# EAGLE design LAUNCHXL-F28027F_RevB (EAGLE 7.3.0)

## Sheet 1 of 2
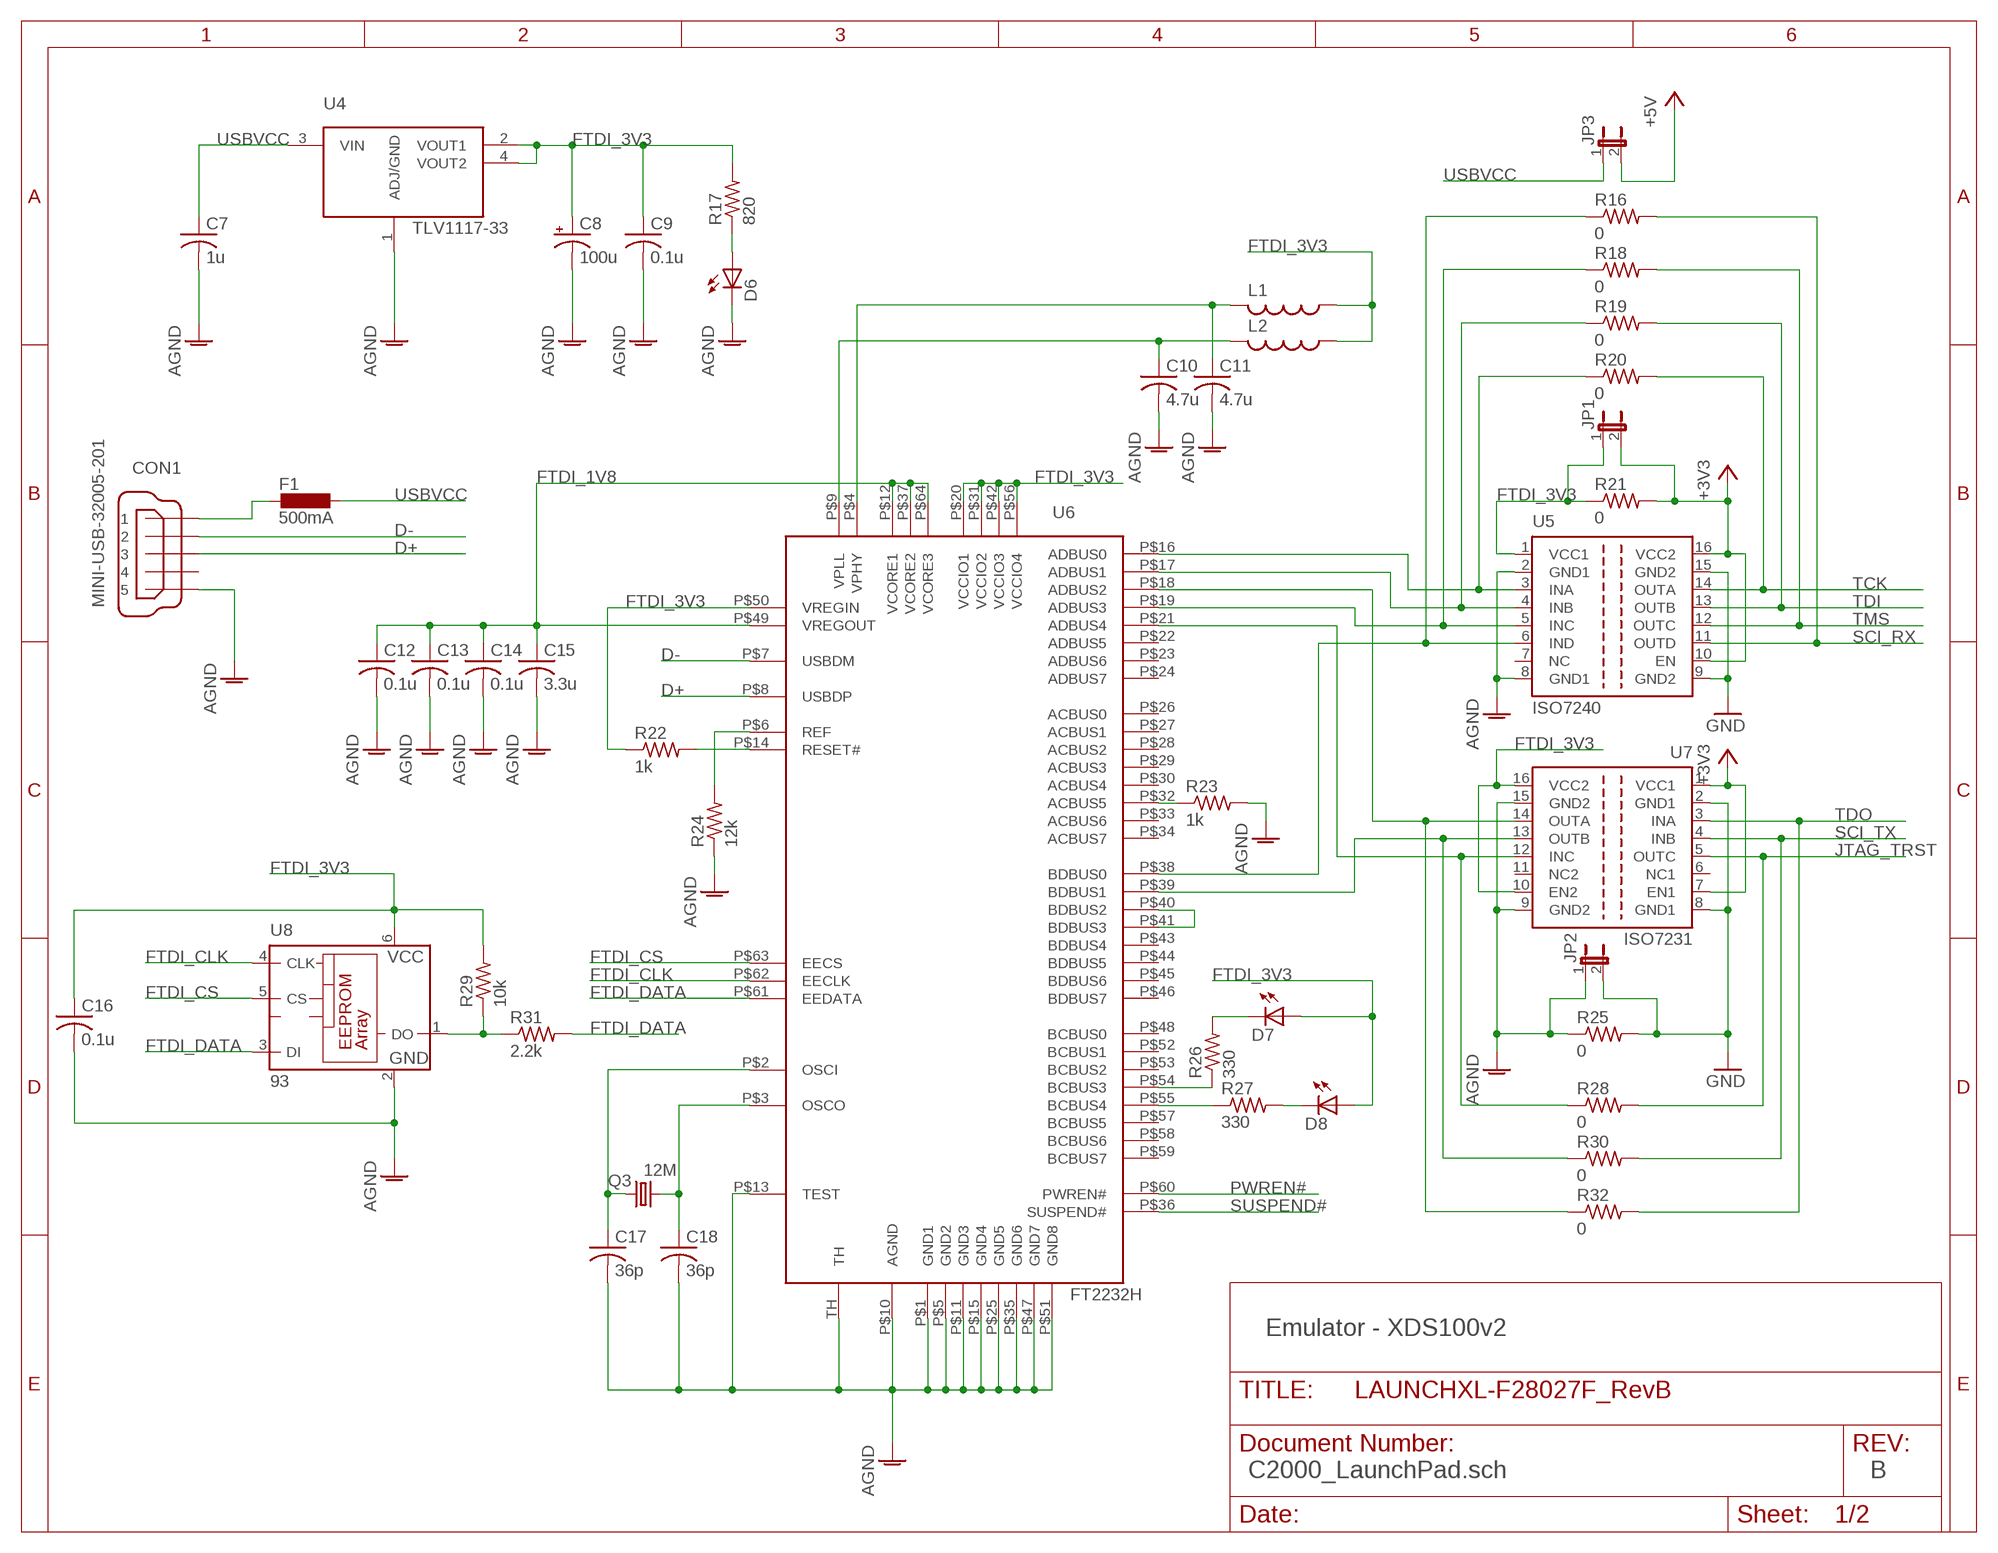
[diagram p0: schematic, sheet 1]

### Parts
C7  1u  C-USC0402  [C0402]
C8  100u  CPOL-USB/3528-21R  [B/3528-21R]
C9  0.1u  C-USC0402  [C0402]
C10  4.7u  C-USC0402  [C0402]
C11  4.7u  C-USC0402  [C0402]
C12  0.1u  C-USC0402  [C0402]
C13  0.1u  C-USC0402  [C0402]
C14  0.1u  C-USC0402  [C0402]
C15  3.3u  C-USC0402  [C0402]
C16  0.1u  C-USC0402  [C0402]
C17  36p  C-USC0402  [C0402]
C18  36p  C-USC0402  [C0402]
CON1  MINI-USB-32005-201  [32005-201]
D6  LEDCHIP-LED0603  [CHIP-LED0603]
D7  LEDCHIP-LED0603  [CHIP-LED0603]
D8  LEDCHIP-LED0603  [CHIP-LED0603]
F1  500mA  L-EUL1812  [L1812]
JP1  JP1ENORM  [JP1]
JP2  JP1ENORM  [JP1]
JP3  JP1ENORM  [JP1]
L1  L-US0402  [R0402]
L2  L-US0402  [R0402]
Q3  12M  CRYSTALHC49UP  [HC49UP]
R16  0  R-US_R1206  [R1206]
R17  820  R-US_R0402  [R0402]
R18  0  R-US_R1206  [R1206]
R19  0  R-US_R1206  [R1206]
R20  0  R-US_R1206  [R1206]
R21  0  R-US_R1206  [R1206]
R22  1k  R-US_R0402  [R0402]
R23  1k  R-US_R0402  [R0402]
R24  12k  R-US_R0402  [R0402]
R25  0  R-US_R1206  [R1206]
R26  330  R-US_R0402  [R0402]
R27  330  R-US_R0402  [R0402]
R28  0  R-US_R1206  [R1206]
R29  10k  R-US_R0402  [R0402]
R30  0  R-US_R1206  [R1206]
R31  2.2k  R-US_R0402  [R0402]
R32  0  R-US_R1206  [R1206]
U4  TLV1117-33  [SOT223]
U5  ISO7240  [SO-16DW]
U6  FT2232H  [QFN64]
U7  ISO7231  [SO-16DW]
U8  93  [SOT23-6]

### Nets
+3V3: JP1.2 R21.2 U5.10(EN) U5.16(VCC2) U7.1(VCC1) U7.7(EN1) ; also sheet 2
+5V: JP3.2 ; also sheet 2
AGND: C7.2 C8.- C9.2 C10.2 C11.2 C12.2 C13.2 C14.2 C15.2 C16.2 C17.2 C18.2 CON1.5 D6.C JP2.1 R23.2 R24.1 R25.1 U4.1(ADJ/GND) U5.2(GND1) U5.8(GND1) U6.P$1(GND1) U6.P$5(GND2) U6.P$10(AGND) U6.P$11(GND3) U6.P$13(TEST) U6.P$15(GND4) U6.P$25(GND5) U6.P$35(GND6) U6.P$47(GND7) U6.P$51(GND8) U6.TH U7.9(GND2) U7.15(GND2) U8.2(GND)
D+: CON1.3 U6.P$8(USBDP)
D-: CON1.2 U6.P$7(USBDM)
FTDI_1V8: C12.1 C13.1 C14.1 C15.1 U6.P$12(VCORE1) U6.P$37(VCORE2) U6.P$49(VREGOUT) U6.P$64(VCORE3)
FTDI_3V3: C8.+ C9.1 C16.1 D7.A D8.A JP1.1 L1.1 L2.1 R17.2 R21.1 R22.1 R29.2 U4.2(VOUT1) U4.4(VOUT2) U5.1(VCC1) U6.P$20(VCCIO1) U6.P$31(VCCIO2) U6.P$42(VCCIO3) U6.P$50(VREGIN) U6.P$56(VCCIO4) U7.10(EN2) U7.16(VCC2) U8.6(VCC)
FTDI_CLK: U6.P$62(EECLK) U8.4(CLK)
FTDI_CS: U6.P$63(EECS) U8.5(CS)
FTDI_DATA: R31.2 U6.P$61(EEDATA) U8.3(DI)
GND: JP2.2 R25.2 U5.9(GND2) U5.15(GND2) U7.2(GND1) U7.8(GND1) ; also sheet 2
JTAG_TRST: R28.2 U7.5(OUTC) ; also sheet 2
N$1: R20.1 U5.3(INA) U6.P$16(ADBUS0)
N$2: C17.1 Q3.1 U6.P$2(OSCI)
N$4: R19.1 U5.4(INB) U6.P$17(ADBUS1)
N$5: R32.1 U6.P$18(ADBUS2) U7.14(OUTA)
N$6: R18.1 U5.5(INC) U6.P$19(ADBUS3)
N$7: C18.1 Q3.2 U6.P$3(OSCO)
N$12: R29.1 R31.1 U8.1(DO)
N$13: R28.1 U6.P$21(ADBUS4) U7.12(INC)
N$14: R23.1 U6.P$32(ACBUS5)
N$15: U6.P$40(BDBUS2) U6.P$41(BDBUS3)
N$16: R16.1 U5.6(IND) U6.P$38(BDBUS0)
N$17: R24.2 U6.P$6(REF)
N$19: R26.1 U6.P$54(BCBUS3)
N$20: C11.1 L1.2 U6.P$4(VPHY)
N$21: R30.1 U6.P$39(BDBUS1) U7.13(OUTB)
N$22: R27.1 U6.P$55(BCBUS4)
N$23: D7.C R26.2
N$24: D8.C R27.2
N$26: C10.1 L2.2 U6.P$9(VPLL)
N$32: D6.A R17.1
N$34: R22.2 U6.P$14(RESET#)
PWREN#: U6.P$60(PWREN#)
SCI_RX: R16.2 U5.11(OUTD) ; also sheet 2
SCI_TX: R30.2 U7.4(INB) ; also sheet 2
SUSPEND#: U6.P$36(SUSPEND#)
TCK: R20.2 U5.14(OUTA) ; also sheet 2
TDI: R19.2 U5.13(OUTB) ; also sheet 2
TDO: R32.2 U7.3(INA) ; also sheet 2
TMS: R18.2 U5.12(OUTC) ; also sheet 2
USBVCC: C7.1 F1.1 JP3.1 U4.3(VIN)
XUSB: CON1.1 F1.2
Unconnected: CON1.4 U5.7(NC) U6.P$22(ADBUS5) U6.P$23(ADBUS6) U6.P$24(ADBUS7) U6.P$26(ACBUS0) U6.P$27(ACBUS1) U6.P$28(ACBUS2) U6.P$29(ACBUS3) U6.P$30(ACBUS4) U6.P$33(ACBUS6) U6.P$34(ACBUS7) U6.P$43(BDBUS4) U6.P$44(BDBUS5) U6.P$45(BDBUS6) U6.P$46(BDBUS7) U6.P$48(BCBUS0) U6.P$52(BCBUS1) U6.P$53(BCBUS2) U6.P$57(BCBUS5) U6.P$58(BCBUS6) U6.P$59(BCBUS7) U7.6(NC1) U7.11(NC2)

### Notes on the sheet
- Emulator - XDS100v2
- C2000_LaunchPad.sch | B

## Sheet 2 of 2
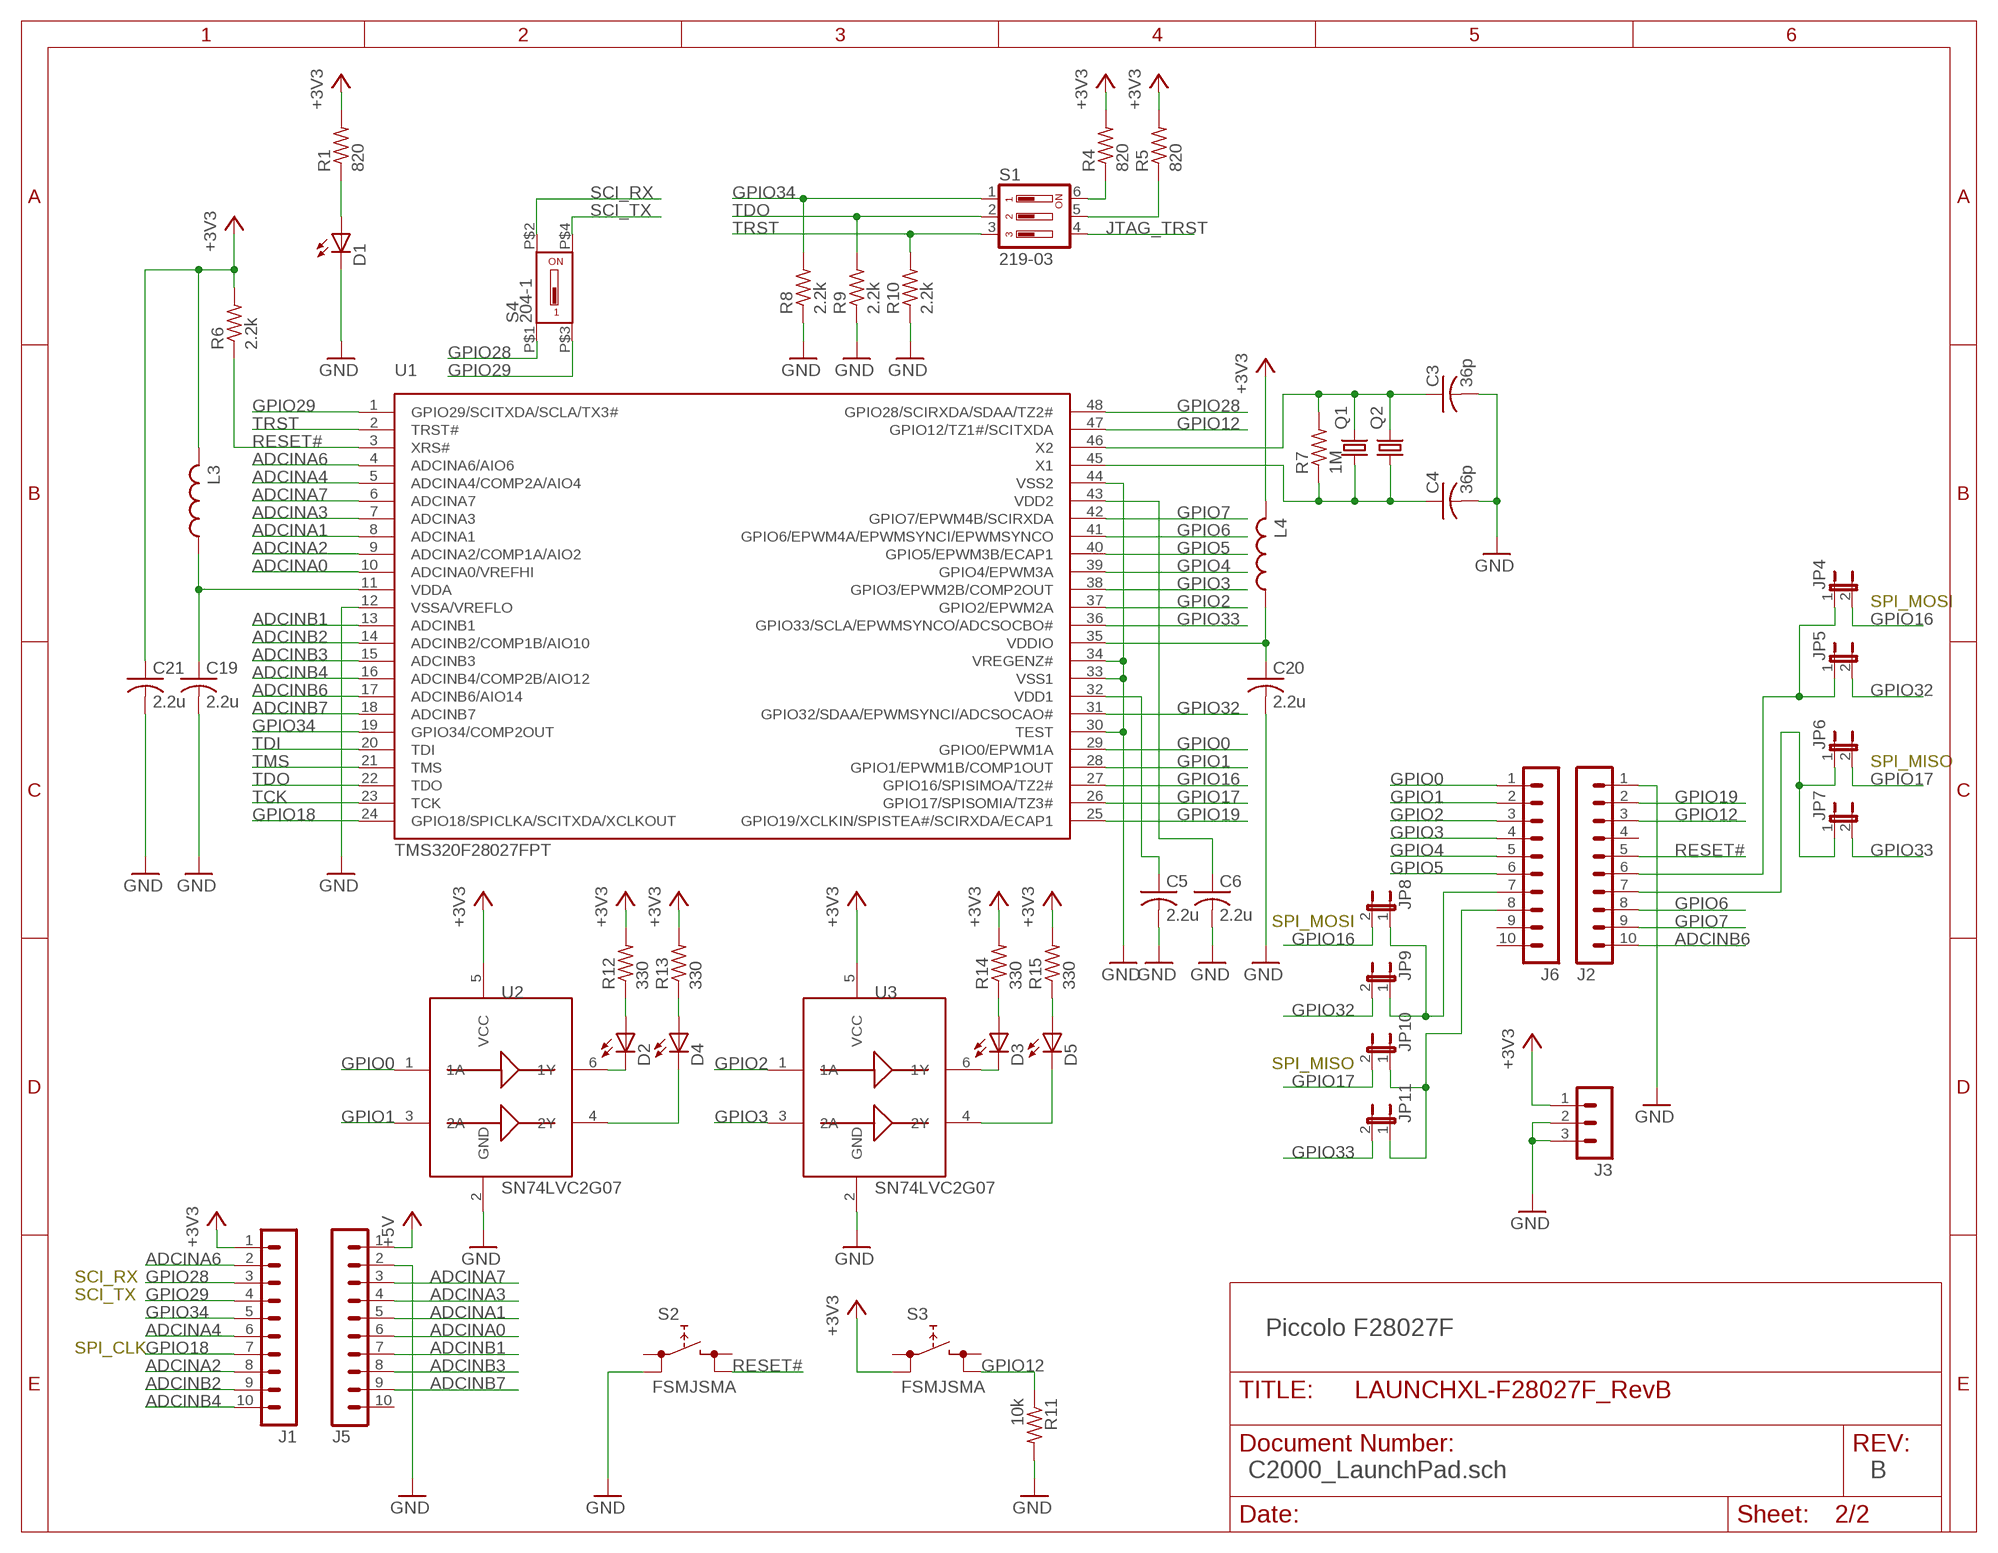
[diagram p1: schematic, sheet 2]

### Parts
C3  36p  C-USC0402  [C0402]
C4  36p  C-USC0402  [C0402]
C5  2.2u  C-USC0402  [C0402]
C6  2.2u  C-USC0402  [C0402]
C19  2.2u  C-USC0402  [C0402]
C20  2.2u  C-USC0402  [C0402]
C21  2.2u  C-USC0402  [C0402]
D1  LEDCHIP-LED0603  [CHIP-LED0603]
D2  LEDCHIP-LED0603  [CHIP-LED0603]
D3  LEDCHIP-LED0603  [CHIP-LED0603]
D4  LEDCHIP-LED0603  [CHIP-LED0603]
D5  LEDCHIP-LED0603  [CHIP-LED0603]
J1  MA10-1  [MA10-1]
J2  MA10-1  [MA10-1]
J3  MA03-1  [MA03-1]
J5  MA10-1  [MA10-1]
J6  MA10-1  [MA10-1]
JP4  JP1ECUT  [C0402]
JP5  JP1ECUT  [C0402]
JP6  JP1ECUT  [C0402]
JP7  JP1ECUT  [C0402]
JP8  JP1ECUT  [C0402]
JP9  JP1ECUT  [C0402]
JP10  JP1ECUT  [C0402]
JP11  JP1ECUT  [C0402]
L3  L-US0402  [R0402]
L4  L-US0402  [R0402]
Q1  CRYSTALHC49S  [HC49/S]
Q2  CRYSTALHC49UP  [HC49UP]
R1  820  R-US_R0402  [R0402]
R4  820  R-US_R0402  [R0402]
R5  820  R-US_R0402  [R0402]
R6  2.2k  R-US_R0402  [R0402]
R7  1M  R-US_R0402  [R0402]
R8  2.2k  R-US_R0402  [R0402]
R9  2.2k  R-US_R0402  [R0402]
R10  2.2k  R-US_R0402  [R0402]
R11  10k  R-US_R0402  [R0402]
R12  330  R-US_R0402  [R0402]
R13  330  R-US_R0402  [R0402]
R14  330  R-US_R0402  [R0402]
R15  330  R-US_R0402  [R0402]
S1  219-03  [CTS-219-03]
S2  FSMJSMA  [FSMJSMA]
S3  FSMJSMA  [FSMJSMA]
S4  204-1  [CTS-204-1]
U1  TMS320F28027FPT  TMS320F28027PT  [PQFP48]
U2  SN74LVC2G07  [SOT23-6-DBV]
U3  SN74LVC2G07  [SOT23-6-DBV]

### Nets
+3V3: C21.1 J1.1 J3.1 L3.2 L4.2 R1.2 R4.2 R5.2 R6.2 R12.2 R13.2 R14.2 R15.2 S3.P$2 U2.5(VCC) U3.5(VCC) ; also sheet 1
+5V: J5.1 ; also sheet 1
ADCINA0: J5.6 U1.10(ADCINA0/VREFHI)
ADCINA1: J5.5 U1.8(ADCINA1)
ADCINA2: J1.8 U1.9(ADCINA2/COMP1A/AIO2)
ADCINA3: J5.4 U1.7(ADCINA3)
ADCINA4: J1.6 U1.5(ADCINA4/COMP2A/AIO4)
ADCINA6: J1.2 U1.4(ADCINA6/AIO6)
ADCINA7: J5.3 U1.6(ADCINA7)
ADCINB1: J5.7 U1.13(ADCINB1)
ADCINB2: J1.9 U1.14(ADCINB2/COMP1B/AIO10)
ADCINB3: J5.8 U1.15(ADCINB3)
ADCINB4: J1.10 U1.16(ADCINB4/COMP2B/AIO12)
ADCINB6: J2.10 U1.17(ADCINB6/AIO14)
ADCINB7: J5.9 U1.18(ADCINB7)
GND: C3.2 C4.2 C5.2 C6.2 C19.2 C20.2 C21.2 D1.C J2.1 J3.2 J3.3 J5.2 R8.1 R9.1 R10.1 R11.2 S2.P$2 U1.12(VSSA/VREFLO) U1.30(TEST) U1.33(VSS1) U1.34(VREGENZ#) U1.44(VSS2) U2.2(GND) U3.2(GND) ; also sheet 1
GPIO0: J6.1 U1.29(GPIO0/EPWM1A) U2.1(1A)
GPIO1: J6.2 U1.28(GPIO1/EPWM1B/COMP1OUT) U2.3(2A)
GPIO2: J6.3 U1.37(GPIO2/EPWM2A) U3.1(1A)
GPIO3: J6.4 U1.38(GPIO3/EPWM2B/COMP2OUT) U3.3(2A)
GPIO4: J6.5 U1.39(GPIO4/EPWM3A)
GPIO5: J6.6 U1.40(GPIO5/EPWM3B/ECAP1)
GPIO6: J2.8 U1.41(GPIO6/EPWM4A/EPWMSYNCI/EPWMSYNCO)
GPIO7: J2.9 U1.42(GPIO7/EPWM4B/SCIRXDA)
GPIO12: J2.3 R11.1 S3.P$4 U1.47(GPIO12/TZ1#/SCITXDA)
GPIO16: JP4.2 JP8.2 U1.27(GPIO16/SPISIMOA/TZ2#)
GPIO17: JP6.2 JP10.2 U1.26(GPIO17/SPISOMIA/TZ3#)
GPIO18: J1.7 U1.24(GPIO18/SPICLKA/SCITXDA/XCLKOUT)
GPIO19: J2.2 U1.25(GPIO19/XCLKIN/SPISTEA#/SCIRXDA/ECAP1)
GPIO28: J1.3 S4.P$1 U1.48(GPIO28/SCIRXDA/SDAA/TZ2#)
GPIO29: J1.4 S4.P$3 U1.1(GPIO29/SCITXDA/SCLA/TX3#)
GPIO32: JP5.2 JP9.2 U1.31(GPIO32/SDAA/EPWMSYNCI/ADCSOCAO#)
GPIO33: JP7.2 JP11.2 U1.36(GPIO33/SCLA/EPWMSYNCO/ADCSOCBO#)
GPIO34: J1.5 R8.2 S1.1 U1.19(GPIO34/COMP2OUT)
J2: J2.6 JP4.1 JP5.1
JTAG_TRST: S1.4 ; also sheet 1
N$3: C19.1 L3.1 U1.11(VDDA)
N$8: C3.1 Q1.2 Q2.2 R7.2 U1.46(X2)
N$9: R4.1 S1.6
N$10: R5.1 S1.5
N$11: C4.1 Q1.1 Q2.1 R7.1 U1.45(X1)
N$18: C5.1 U1.32(VDD1)
N$25: C6.1 U1.43(VDD2)
N$27: D1.A R1.1
N$28: D2.C U2.6(1Y)
N$29: D4.C U2.4(2Y)
N$30: D2.A R12.1
N$31: D4.A R13.1
N$35: D3.C U3.6(1Y)
N$36: D5.C U3.4(2Y)
N$37: D3.A R14.1
N$38: D5.A R15.1
N$39: C20.1 L4.1 U1.35(VDDIO)
N$41: J6.7 JP8.1 JP9.1
N$42: J2.7 JP6.1 JP7.1
N$48: J6.8 JP10.1 JP11.1
RESET#: J2.5 R6.1 S2.P$4 U1.3(XRS#)
SCI_RX: S4.P$2 ; also sheet 1
SCI_TX: S4.P$4 ; also sheet 1
TCK: U1.23(TCK) ; also sheet 1
TDI: U1.20(TDI) ; also sheet 1
TDO: R9.2 S1.2 U1.22(TDO) ; also sheet 1
TMS: U1.21(TMS) ; also sheet 1
TRST: R10.2 S1.3 U1.2(TRST#)
Unconnected: J2.4 J5.10 J6.9 J6.10 S2.P$1 S2.P$3 S3.P$1 S3.P$3

### Notes on the sheet
- SPI_MOSI
- SPI_MISO
- SPI_MOSI
- SPI_MISO
- SCI_RX
- SCI_TX
- Piccolo F28027F
- SPI_CLK
- C2000_LaunchPad.sch | B

## Library data of the parts
C3-C7 C9-C21 = rcl:C-US: CAPACITOR, American symbol
C8 = rcl:CPOL-US: POLARIZED CAPACITOR, American symbol
CON1 = con-cypressindustries:MINI-USB-: MINI USB-B Conector Source: www.cypressindustries.com; OC_FARNELL: unknown; OC_NEWARK: unknown
D1-D8 = led:LED: LED OSRAM: - CHIPLED LG R971, LG N971, LY N971, LG Q971, LY Q971, LO R971, LY R971 LH N974, LH R974 LS Q976, LO Q976, LY Q976 LO Q996 - Hyper CHIPLED LW Q18S LB Q993, LB Q99A, LB R99A - SideLED LS A670, LO A670, LY A670, LG A670, LP A670 LB A673, LV A673, LT A673, LW A673 LH A674 LY A675 LS A676, LA A676, LO A676, LY A676, LW A676 LS A679, LY A679, LG A679 - Hyper Micro SIDELED® LS Y876, LA Y876, LO Y876, LY Y876 LT Y87S - SmartLED LW L88C, LW L88S LB L89C, LB L89S, LG L890 LS L89K, LO L89K, LY L89K LS L896, LA L896, LO L896, LY L896 - TOPLED LS T670, LO T670, LY T670, LG T670, LP T670 LSG T670, LSP T670, LSY T670, LOP T670, LYG T670 LG T671, LOG T671, LSG T671 LB T673, LV T673, LT T673, LW T673 LH T674 LS T676, LA T676, LO T676, LY T676, LB T676, LH T676, LSB T676, LW T676 LB T67C, LV T67C, LT T67C, LS T67K, LO T67K, LY T67K, LW E67C LS E67B, LA E67B, LO E67B, LY E67B, LB E67C, LV E67C, LT E67C LW T67C LS T679, LY T679, LG T679 LS T770, LO T770, LY T770, LG T770, LP T770 LB T773, LV T773, LT T773, LW T773 LH T774 LS E675, LA E675, LY E675, LS T675 LS T776, LA T776, LO T776, LY T776, LB T776 LHGB T686 LT T68C, LB T68C - Hyper Mini TOPLED® LB M676 - Mini TOPLED Santana® LG M470 LS M47K, LO M47K, LY M47K Source: http://www.osram.convergy.de LUXEON: - LUMILED® LXK2-PW12-R00, LXK2-PW12-S00, LXK2-PW14-U00, LXK2-PW14-V00 LXK2-PM12-R00, LXK2-PM12-S00, LXK2-PM14-U00 LXK2-PE12-Q00, LXK2-PE12-R00, LXK2-PE12-S00, LXK2-PE14-T00, LXK2-PE14-U00 LXK2-PB12-K00, LXK2-PB12-L00, LXK2-PB12-M00, LXK2-PB14-N00, LXK2-PB14-P00, LXK2-PB14-Q00 LXK2-PR12-L00, LXK2-PR12-M00, LXK2-PR14-Q00, LXK2-PR14-R00 LXK2-PD12-Q00, LXK2-PD12-R00, LXK2-PD12-S00 LXK2-PH12-R00, LXK2-PH12-S00 LXK2-PL12-P00, LXK2-PL12-Q00, LXK2-PL12-R00 Source: www.luxeon.com KINGBRIGHT: KA-3528ASYC Source: www.kingbright.com
F1 = rcl:L-EU: INDUCTOR, European symbol
J1 J2 J5 J6 = con-lstb:MA10-1: PIN HEADER; OC_FARNELL: unknown; OC_NEWARK: unknown
J3 = con-lstb:MA03-1: PIN HEADER; OC_FARNELL: unknown; OC_NEWARK: unknown
JP1-JP11 = jumper:JP1E: JUMPER
L1-L4 = rcl:L-US: INDUCTOR, American symbol
Q1 = crystal:CRYSTAL: CRYSTAL; OC_FARNELL: 1667008; OC_NEWARK: unknown
Q2 Q3 = crystal:CRYSTAL: CRYSTAL; OC_FARNELL: unknown; OC_NEWARK: unknown
R1 R4-R32 = rcl:R-US_: RESISTOR, American symbol
S1 = switch-dil:219-03*: Surface Mount DIP Switch Series 219 SMT CTS Electronic Components Sourc: www.ctscorp.com; OC_FARNELL: unknown; OC_NEWARK: unknown
S2 S3 = switch:FSMJSMA
S4 = switch-dil:204-1*
U1 = texas:TMS320F28027
U2 U3 = texas:SN74LVC2G07
U4 = texas:TLV1117
U5 = texas:ISO7240: HIGH SPEED QUAD DIGITAL ISOLATORS Source: http://focus.ti.com/lit/ds/symlink/iso7240m.pdf; MPN: ISO7240MDW; OC_FARNELL: 1755124; OC_NEWARK: 58M0385
U6 = ti_trey:FT2232H
U7 = texas:ISO7231
U8 = ti_trey:93*: Serial EPROM 1 K/2 K/4 K, low voltage, Microwire

## Net classes
0 default: width 0.152 mm, drill 0.305 mm, clearance 0.152 mm

## Board
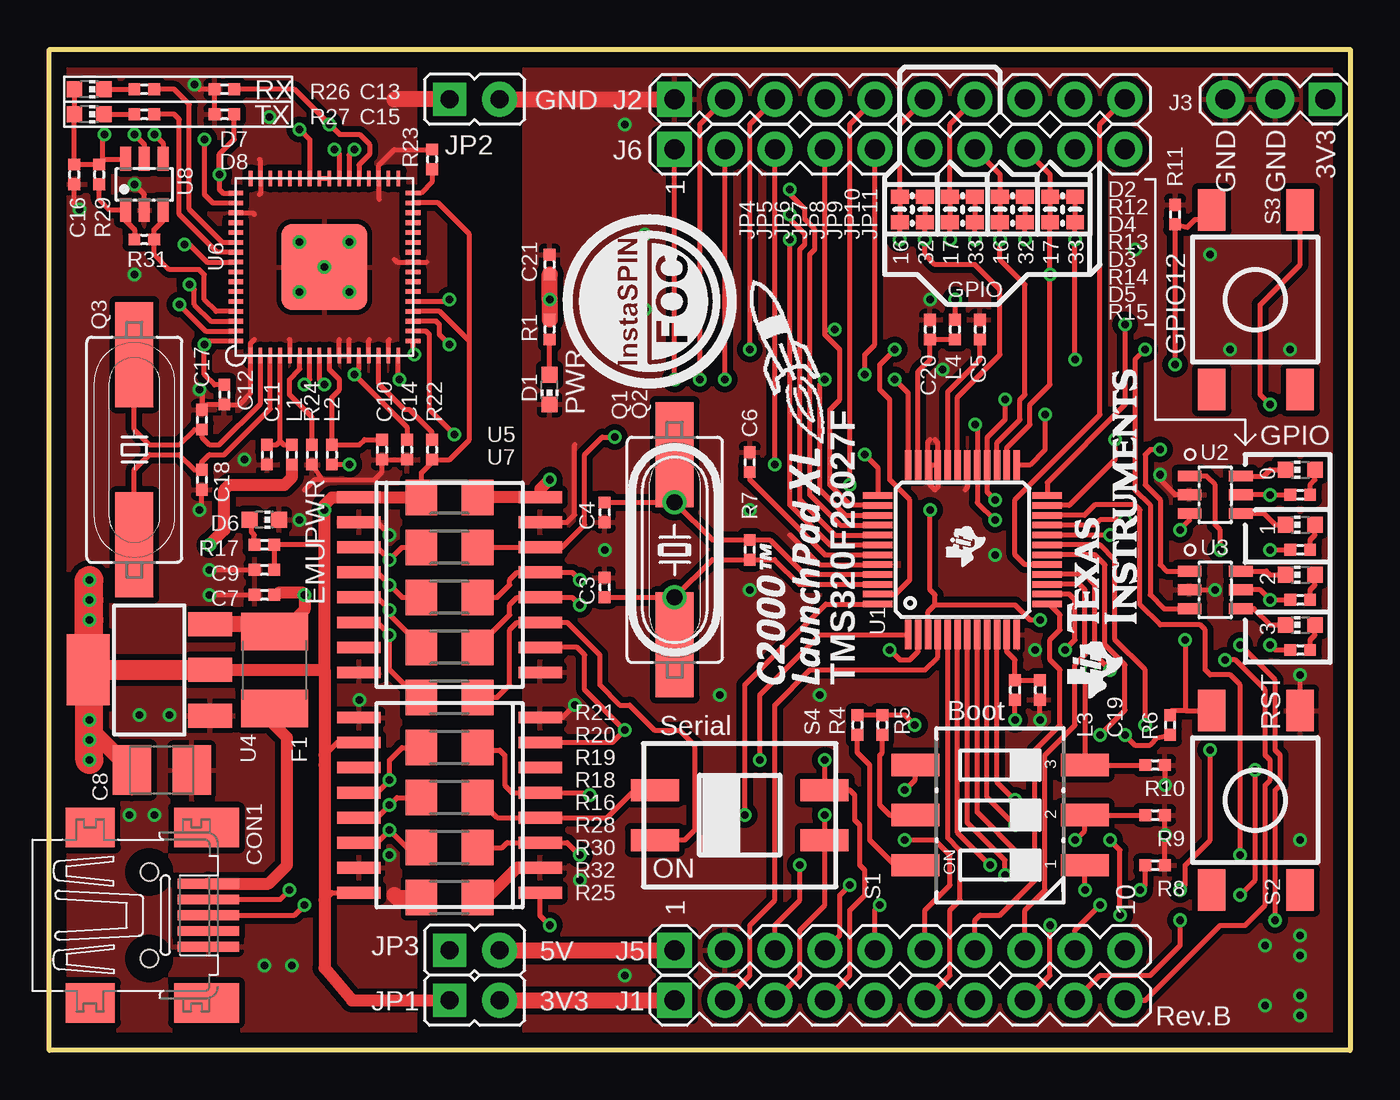
[diagram p2: board, top side]
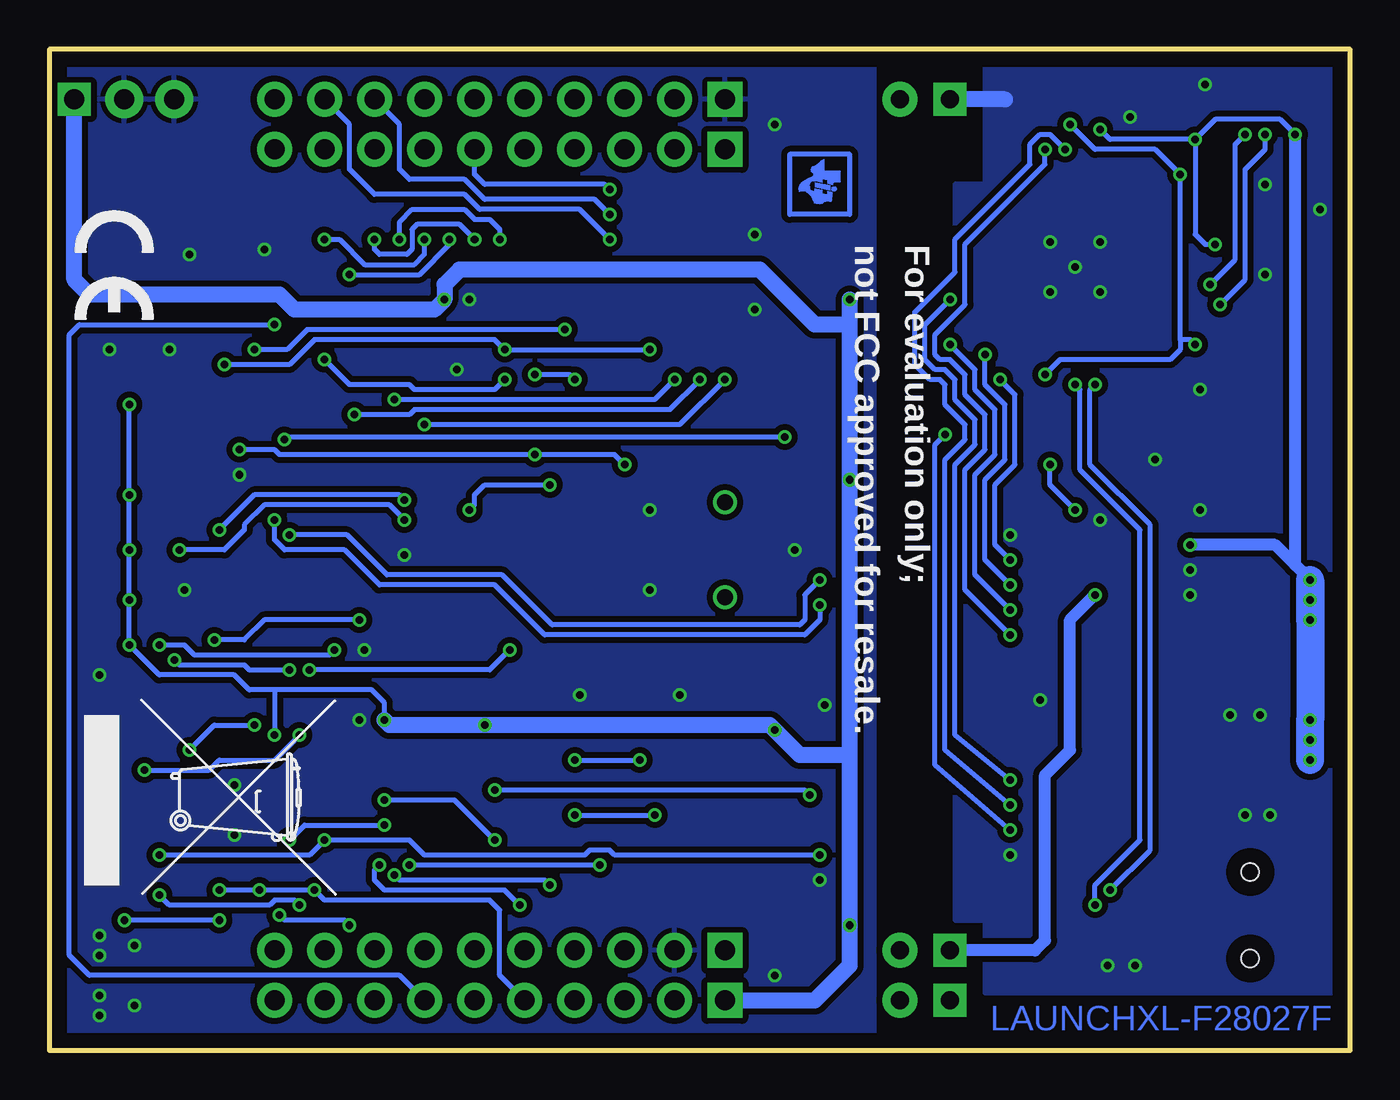
[diagram p3: board, bottom side, seen from below]

Size 66.04 x 50.8 mm. Coordinates in mm from the lower left corner, seen from the top.
Outline: 0,50.8 66.04,50.8 66.04,0 0,0 0,50.8
Copper layers (1*16): Top 0.035mm / dielectric 1.5mm / Bottom 0.035mm
Design rules "default *": minimum track width 6mil, minimum drill 15mil, track to track 6mil, track to pad 6mil, pad to pad 6mil, via to via 6mil, smd to smd 6mil, copper to edge 30mil, drill to drill 12mil, minimum pad ring 6mil, minimum via ring 6mil, stop-mask expansion 1mil, vias tented up to drill 20mil, thermal gap 10mil
bRestrict: area 25.7,42.7 to 28.2,45.2

### Footprints (pad centres in the part's own frame; a part is rotated, then mirrored left to right if it is on the bottom)
C0402 = smd 0.6 x 0.6: 1 -0.5,0; 2 0.5,0
B/3528-21R = smd 1.95 x 2.5: + 1.525,0; - -1.525,0
32005-201 = smd 3.1 x 0.5: 1 3,1.6; 2 3,0.8; 3 3,0; 4 3,-0.8; 5 3,-1.6 | smd 2.5 x 2: M1 -3,-4.45; M2 -3,4.45 | smd 3.3 x 2: M3 2.9,4.45; M4 2.9,-4.45 | hole 0.9: 0,2.2; 0,-2.2
CHIP-LED0603 = smd 0.8 x 0.8: A 0,-0.75; C 0,0.75
L1812 = smd 1.9 x 3.4: 1 -1.95,0; 2 1.95,0
MA10-1 = drill 1.016 pad 1.778 square: 1 -11.43,0 | drill 1.016 pad 1.778: 2 -8.89,0; 3 -6.35,0; 4 -3.81,0; 5 -1.27,0; 6 1.27,0; 7 3.81,0; 8 6.35,0; 9 8.89,0; 10 11.43,0
MA03-1 = drill 1.016 pad 1.676 square: 1 -2.54,0 | drill 1.016 pad 1.93: 2 0,0; 3 2.54,0
JP1 = drill 0.914 pad 1.676 square: 1 0,-1.27 | drill 0.914 pad 1.778: 2 0,1.27
C0402' = smd 0.7 x 0.9: 1 -0.65,0; 2 0.65,0
R0402 = smd 0.6 x 0.6: 1 -0.5,0; 2 0.5,0
HC49/S = drill 0.813: 1 -2.413,0; 2 2.413,0
HC49UP = smd 5.334 x 1.93: 1 -4.826,0; 2 4.826,0
R1206 = smd 1.6 x 1.803: 1 -1.422,0; 2 1.422,0
CTS-219-03 = smd 1.13 x 2.44: 1 -2.54,-4.3; 2 0,-4.3; 3 2.54,-4.3; 4 2.54,4.3; 5 0,4.3; 6 -2.54,4.3
FSMJSMA = smd 1.397 x 2.108: P$1 0,0; P$2 0,-9.119; P$3 4.496,0; P$4 4.496,-9.119
CTS-204-1 = smd 1.118 x 2.438: P$1 -1.27,-4.305; P$2 -1.27,4.305; P$3 1.27,-4.305; P$4 1.27,4.305
PQFP48 = smd 1.5 x 0.33: 1 -4.3,2.75; 2 -4.3,2.25; 3 -4.3,1.75; 4 -4.3,1.25; 5 -4.3,0.75; 6 -4.3,0.25; 7 -4.3,-0.25; 8 -4.3,-0.75; 9 -4.3,-1.25; 10 -4.3,-1.75; 11 -4.3,-2.25; 12 -4.3,-2.75; 25 4.3,-2.75; 26 4.3,-2.25; 27 4.3,-1.75; 28 4.3,-1.25; 29 4.3,-0.75; 30 4.3,-0.25; 31 4.3,0.25; 32 4.3,0.75; 33 4.3,1.25; 34 4.3,1.75; 35 4.3,2.25; 36 4.3,2.75 | smd 0.33 x 1.5: 13 -2.75,-4.3; 14 -2.25,-4.3; 15 -1.75,-4.3; 16 -1.25,-4.3; 17 -0.75,-4.3; 18 -0.25,-4.3; 19 0.25,-4.3; 20 0.75,-4.3; 21 1.25,-4.3; 22 1.75,-4.3; 23 2.25,-4.3; 24 2.75,-4.3; 37 2.75,4.3; 38 2.25,4.3; 39 1.75,4.3; 40 1.25,4.3; 41 0.75,4.3; 42 0.25,4.3; 43 -0.25,4.3; 44 -0.75,4.3; 45 -1.25,4.3; 46 -1.75,4.3; 47 -2.25,4.3; 48 -2.75,4.3
SOT23-6-DBV = smd 0.55 x 1.2: 1 -0.95,-1.3; 2 0,-1.3; 3 0.95,-1.3; 4 0.95,1.3; 5 0,1.3; 6 -0.95,1.3
SOT223 = smd 1.219 x 2.235: 1 -2.311,-3.099; 2 0,-3.099; 3 2.311,-3.099 | smd 3.6 x 2.2: 4 0,3.099
SO-16DW = smd 0.6 x 2.2: 1 -4.445,-4.6; 2 -3.175,-4.6; 3 -1.905,-4.6; 4 -0.635,-4.6; 5 0.635,-4.6; 6 1.905,-4.6; 7 3.175,-4.6; 8 4.445,-4.6; 9 4.445,4.6; 10 3.175,4.6; 11 1.905,4.6; 12 0.635,4.6; 13 -0.635,4.6; 14 -1.905,4.6; 15 -3.175,4.6; 16 -4.445,4.6
QFN64 = smd 0.8 x 0.25: P$1 -4.5,3.75; P$2 -4.5,3.25; P$3 -4.5,2.75; P$4 -4.5,2.25; P$5 -4.5,1.75; P$6 -4.5,1.25; P$7 -4.5,0.75; P$8 -4.5,0.25; P$9 -4.5,-0.25; P$10 -4.5,-0.75; P$11 -4.5,-1.25; P$12 -4.5,-1.75; P$13 -4.5,-2.25; P$14 -4.5,-2.75; P$15 -4.5,-3.25; P$16 -4.5,-3.75; P$33 4.5,-3.75; P$34 4.5,-3.25; P$35 4.5,-2.75; P$36 4.5,-2.25; P$37 4.5,-1.75; P$38 4.5,-1.25; P$39 4.5,-0.75; P$40 4.5,-0.25; P$41 4.5,0.25; P$42 4.5,0.75; P$43 4.5,1.25; P$44 4.5,1.75; P$45 4.5,2.25; P$46 4.5,2.75; P$47 4.5,3.25; P$48 4.5,3.75 | smd 0.25 x 0.8: P$17 -3.75,-4.5; P$18 -3.25,-4.5; P$19 -2.75,-4.5; P$20 -2.25,-4.5; P$21 -1.75,-4.5; P$22 -1.25,-4.5; P$23 -0.75,-4.5; P$24 -0.25,-4.5; P$25 0.25,-4.5; P$26 0.75,-4.5; P$27 1.25,-4.5; P$28 1.75,-4.5; P$29 2.25,-4.5; P$30 2.75,-4.5; P$31 3.25,-4.5; P$32 3.75,-4.5; P$49 3.75,4.5; P$50 3.25,4.5; P$51 2.75,4.5; P$52 2.25,4.5; P$53 1.75,4.5; P$54 1.25,4.5; P$55 0.75,4.5; P$56 0.25,4.5; P$57 -0.25,4.5; P$58 -0.75,4.5; P$59 -1.25,4.5; P$60 -1.75,4.5; P$61 -2.25,4.5; P$62 -2.75,4.5; P$63 -3.25,4.5; P$64 -3.75,4.5 | smd 4.35 x 4.35: TH 0,0
SOT23-6 = smd 0.55 x 1.2: 1 -0.95,-1.3; 2 0,-1.3; 3 0.95,-1.3; 4 0.95,1.3; 5 0,1.3; 6 -0.95,1.3

### Placement (x,y rotation side)
C3  28.19,23.5 90 top
C4  28.19,27.3 270 top
C5  47.24,36.58 90 top
C6  35.56,29.84 90 top
C7  10.92,23.11 180 top
C8  5.71,14.22 180 top
C9  10.92,24.38 180 top
C10  16.89,30.48 270 top
C11  11.05,30.23 270 top
C12  8.89,33.27 270 top
C13  8.89,48.77 180 top
C14  18.16,30.48 270 top
C15  8.89,47.5 180 top
C16  1.27,44.45 270 top
C17  7.75,32 90 top
C18  7.75,28.96 270 top
C19  50.29,18.29 270 top
C20  44.7,36.58 90 top
C21  25.4,39.88 90 top
CON1  5.08,6.86 0 top
D1  25.4,33.53 180 top
D2  63.5,29.46 90 top
D3  63.5,24.13 90 top
D4  63.5,26.67 90 top
D5  63.5,21.59 90 top
D6  10.92,26.92 270 top
D7  2.03,48.77 270 top
D8  2.03,47.5 270 top
F1  11.43,19.3 270 top
J1  43.18,2.54 0 top
J2  43.18,48.26 0 top
J3  62.23,48.26 180 top
J5  43.18,5.08 0 top
J6  43.18,45.72 0 top
JP1  21.59,2.54 270 top
JP2  21.59,48.26 270 top
JP3  21.59,5.08 270 top
JP4  [C0402']  43.18,42.67 270 top
JP5  [C0402']  44.45,42.67 270 top
JP6  [C0402']  45.72,42.67 270 top
JP7  [C0402']  46.99,42.67 270 top
JP8  [C0402']  48.26,42.67 270 top
JP9  [C0402']  49.53,42.67 270 top
JP10  [C0402']  50.8,42.67 270 top
JP11  [C0402']  52.07,42.67 270 top
L1  12.32,30.23 90 top
L2  14.35,30.23 90 top
L3  49.02,18.29 270 top
L4  45.97,36.58 90 top
Q1  31.75,25.4 270 top
Q2  31.75,25.4 270 top
Q3  4.32,30.48 270 top
R1  25.4,36.58 90 top
R4  41.02,16.51 90 top
R5  42.29,16.51 90 top
R6  56.9,16.51 270 top
R7  35.56,25.4 270 top
R8  56.13,9.4 180 top
R9  56.13,11.94 180 top
R10  56.13,14.48 180 top
R11  57.15,42.42 90 top
R12  63.5,28.19 180 top
R13  63.5,25.4 180 top
R14  63.5,22.86 180 top
R15  63.5,20.32 180 top
R16  20.32,17.91 0 top
R17  10.92,25.65 0 top
R18  20.32,20.45 0 top
R19  20.32,22.99 0 top
R20  20.32,25.53 0 top
R21  20.32,28.07 0 top
R22  19.43,30.48 90 top
R23  19.43,45.21 90 top
R24  13.34,30.23 90 top
R25  20.32,7.75 0 top
R26  4.83,48.77 180 top
R27  4.83,47.5 180 top
R28  20.32,15.37 0 top
R29  2.54,44.45 90 top
R30  20.32,12.83 0 top
R31  4.83,41.15 0 top
R32  20.32,10.29 0 top
S1  48.26,11.94 90 top
S2  63.5,8.13 180 top
S3  63.5,33.53 180 top
S4  35.05,11.94 90 top
U1  46.35,25.4 90 top
U2  59.18,28.19 270 top
U3  59.18,23.37 270 top
U4  5.08,19.3 90 top
U5  20.32,23.62 270 top
U6  13.97,39.75 90 top
U7  20.32,12.45 90 top
U8  4.83,43.94 0 top
U$1  [TRADEMARK]  36.83,24.38 90 top
U$2  [XL]  39.12,28.19 90 top
U$3  [MSP430_LAB_TILOGO_SMALL]  26.67,43.94 270 bottom
U$4  [STI_LOGO_LOGO16_TPLACE]  55.37,17.78 90 top
U$5  [STI_LOGO_ROCKET]  39.37,30.73 90 top
U$6  [STI_LOGO_LAUNCHPADC2K]  39.12,18.54 90 top
U$7  [CE-4MM]  64.77,42.67 270 bottom
U$8  [MSP430_LAB_TILOGO_SMALL_TSTOP]  26.67,43.94 270 bottom
U$11  [TONNE_10.00]  58.42,12.95 270 bottom

### Tracks (layer width: path | path; a pad name or v marks a point on that pad's centre or on a via)
+3V3  (via drill 0.38)
  Top 0.254: U7.1 24.92,6.83 v25.4,6.35 | R12.2 v61.98,28.19 U2.5 | v61.98,25.4 R13.2 | R14.2 v61.98,22.86 61.47,23.37 U3.5 | 61.72,33.02 v61.98,32.77 61.47,33.27 61.47,37.85 63.5,39.88 S3.P$2 | v49.02,16.76 L3.2 | U7.7 28.57,15.62 v29.21,16.26 27.18,18.29 27.18,20.07 26.8,20.45 U5.10 | v45.97,38.1 L4.2 | R4.2 R5.2 43.44,17.01 v43.94,16.51 | R15.2 62.23,20.32 v61.98,20.57 | R6.2 56.25,15.86 55.88,15.49 55.12,15.49 v54.61,16
  Top 0.61: R21.2 U5.16 24.92,28.48 v25.4,28.96
  Top 0.813: R1.2 v25.4,38.1 C21.1 | JP1.2 J1.1
  Bottom 0.254: v61.98,32.77 v61.98,28.19 v61.98,25.4 v61.98,22.86 v61.98,20.57 60.45,19.05 56.64,19.05 55.88,18.29 54.61,18.29 | 54.61,18.29 49.67,18.29 49.02,17.64 v49.02,16.76 | 54.61,18.29 v54.61,16
  Bottom 0.813: 25.4,36.83 27.18,36.83 29.97,39.62 45.21,39.62 45.97,38.86 v45.97,38.1 46.48,37.59 53.59,37.59 54.36,38.35 64.01,38.35 64.77,39.12 J3.1 | 25.4,36.83 v25.4,28.96 25.4,14.99 | v49.02,16.76 48.77,16.51 v43.94,16.51 29.46,16.51 v29.21,16.26 27.94,14.99 25.4,14.99 | 25.4,36.83 v25.4,38.1 | 25.4,14.99 v25.4,6.35 25.4,4.32 27.18,2.54 J1.1
+5V
  Top 0.813: JP3.2 J5.1
ADCINA0  (via drill 0.38)
  Top 0.254: U1.10 48.1,13.62 v49.02,12.7 | v43.43,10.67 44.96,10.67 45.72,9.91 45.72,8.38 44.45,7.11 J5.6
  Bottom 0.254: v49.02,12.7 45.47,12.7 v43.43,10.67
ADCINA1  (via drill 0.38)
  Top 0.254: v49.28,9.4 49.28,9.91 47.1,12.08 U1.8 | J5.5 41.91,7.11 v42.16,7.37
  Bottom 0.254: v42.16,7.37 42.93,8.13 49.02,8.13 49.53,8.64 49.53,9.14 v49.28,9.4
ADCINA2  (via drill 0.38)
  Top 0.254: U1.9 47.6,12.85 v49.02,11.43 | v54.36,6.86 54.36,10.16 v53.85,10.67 | v50.8,6.35 50.8,3.81 J1.8
  Bottom 0.254: v49.02,11.43 53.09,11.43 v53.85,10.67 | v50.8,6.35 51.05,6.6 54.1,6.6 v54.36,6.86
ADCINA3  (via drill 0.38)
  Top 0.254: v48.51,8.89 48.51,9.65 46.6,11.56 U1.7 | v40.64,8.38 40.13,7.87 40.13,5.84 J5.4
  Bottom 0.254: v40.64,8.38 40.89,8.64 48.26,8.64 v48.51,8.89
ADCINA4
  Top 0.254: U1.5 45.6,10.78 46.23,10.16 46.23,7.62 45.72,7.11 45.72,3.81 J1.6
ADCINA6
  Top 0.254: U1.4 45.1,19.96 44.45,19.3 38.61,19.3 36.83,17.53 36.83,7.62 35.56,6.35 35.56,3.81 J1.2
ADCINA7  (via drill 0.38)
  Top 0.254: U1.6 46.1,11.04 v47.75,9.4 | v38.1,9.4 38.1,7.62 36.83,6.35 J5.3
  Bottom 0.254: v38.1,9.4 v47.75,9.4
ADCINB1
  Top 0.254: U1.13 50.76,22.65 51.31,22.1 51.31,21.34 50.8,20.83 50.8,19.81 51.31,19.3 51.31,16.51 50.04,15.24 50.04,8.64 48.26,6.86 47.24,6.86 46.99,6.6 J5.7
ADCINB2  (via drill 0.38)
  Top 0.254: U1.14 51.78,23.15 52.07,22.86 52.07,20.83 v51.56,20.32 | v60.45,20.57 62.23,18.8 62.23,15.24 62.48,14.99 62.48,13.46 62.23,13.21 v62.23,6.6 | J1.9 53.34,3.81 55.88,3.81 57.4,5.33 v57.4,6.6
  Bottom 0.254: v57.4,6.6 v62.23,6.6 | v51.56,20.32 51.82,20.07 58.67,20.07 59.18,20.57 v60.45,20.57
ADCINB3
  Top 0.254: U1.15 52.3,23.65 52.58,23.37 52.58,20.07 52.07,19.56 52.07,16.51 50.55,14.99 50.55,8.13 49.53,7.11 J5.8
ADCINB4  (via drill 0.38)
  Top 0.254: U1.16 52.56,24.15 53.09,23.62 53.09,20.07 v53.85,19.3 | v59.69,19.81 60.2,19.81 61.72,18.29 61.72,14.99 61.98,14.73 61.98,13.72 61.72,13.46 61.72,7.37 60.71,6.35 59.44,6.35 55.63,2.54 J1.10
  Bottom 0.254: v53.85,19.3 55.88,19.3 56.13,19.56 59.44,19.56 v59.69,19.81
ADCINB6
  Top 0.254: J2.10 53.34,46.99 53.34,32.26 49.02,27.94 49.02,25.15 49.52,24.65 U1.17
ADCINB7  (via drill 0.38)
  Top 0.254: U1.18 53.08,25.15 53.59,24.64 53.59,20.57 54.61,19.56 54.61,17.27 v53.34,16 | v60.45,7.87 61.21,8.64 v61.21,14.22 | J5.9 52.07,6.1 v53.34,7.37
  Bottom 0.254: v53.34,7.37 53.59,7.62 54.61,7.62 54.86,7.37 59.94,7.37 v60.45,7.87 | v61.21,14.22 57.91,14.22 57.4,14.73 54.61,14.73 v53.34,16
AGND  (via drill 0.38)
  Top 0.254: 19.17,40 U6.P$25 17.66,40 17.53,40.13 | U6.P$51 10.33,42.5 10.41,42.42 | 10.67,43.43 10.72,43.49 U6.P$47 10.72,45.16 10.67,45.21 | U6.P$15 17.22,36.02 17.27,36.07 | U6.P$13 16.22,36.03 16.26,36.07 | U6.P$11 15.22,36.05 15.24,36.07 | U6.P$10 14.72,36.06 14.73,36.07 | U6.P$5 12.22,36.04 12.19,36.07 | 10.41,36.07 10.22,35.87 U6.P$1 10.22,33.33 9.66,32.77 C12.2 8.02,32.77 C17.2 7.78,32.62 7.78,33.37 v7.62,33.53 | 16.76,43.18 16.72,43.22 U6.P$35 16.72,44.91 17.52,45.71 R23.2 | v7.37,49.02 7.62,48.77 C13.2 C15.2 | C18.2 7.75,27.56 v7.62,27.43 | v8.13,23.11 C7.2 | v8.13,24.38 C9.2 | C14.2 C10.2 16.89,29.34 16.51,28.96 13.84,28.96 | 12.95,28.45 13.46,28.96 13.84,28.96 | R24.1 13.84,28.96 | U5.2 16.64,26.8 v17.27,26.16 | C16.2 1.27,42.93 v1.52,42.67 | U8.2 4.83,43.43 v4.32,43.94
  Top 0.813: JP2.1 17.53,48.26 | R25.1 17.65,7.75 17.53,7.87
  Bottom 0.813: 17.53,48.26 JP2.1
  other vias: 13.97,39.75 12.7,41.02 15.24,41.02 15.24,38.48 12.7,38.48 10.92,4.32 17.27,9.91 12.32,4.32 15.75,17.78 6.1,17.02 5.33,11.94 4.06,11.94 4.57,17.02 9.91,29.97 12.7,26.92 4.32,39.37 11.18,47.37
  pour Top (isolate 0.305): 0.51,50.16 18.54,50.16 18.54,43.94 20.07,43.94 20.07,28.96 17.78,28.96 17.78,6.6 18.54,6.6 18.54,0.64 0.51,0.64
  pour Bottom (isolate 0.305): 0.51,50.16 18.54,50.16 18.54,43.94 20.07,43.94 20.07,6.6 18.54,6.6 18.54,2.92 0.51,2.92
D+  (via drill 0.38)
  Top 0.254: U6.P$8 13.72,34.03 v13.97,33.78 | CON1.3 12.45,6.86 v12.95,7.37
  Bottom 0.254: v13.97,33.78 13.72,33.53 13.72,29.46 10.67,26.42 10.67,10.67 12.95,8.38 v12.95,7.37
D-  (via drill 0.38)
  Top 0.254: U6.P$7 13.22,34.05 v12.95,33.78 | CON1.2 11.72,7.66 v12.19,8.13
  Bottom 0.254: v12.95,33.78 13.21,33.53 13.21,29.72 10.16,26.67 10.16,10.16 v12.19,8.13
FTDI_1V8  (via drill 0.38)
  Top 0.254: U6.P$37 15.72,44.93 16.26,45.47 16.26,45.97 15.75,46.48 14.73,46.48 v14.22,46.99 12.45,48.77 C13.1 | U6.P$64 8.06,36 v7.87,35.81 7.87,34.29 8.39,33.77 C12.1 | C14.1 18.16,31.62 v15.49,34.29 15.72,34.57 U6.P$12 | U6.P$49 8.82,43.5 8.64,43.69 v8.64,44.45 8.64,45.47 9.4,46.23 C15.1
  Bottom 0.254: v14.22,46.99 12.95,45.72 9.91,45.72 v8.64,44.45 8.64,36.07 | 8.64,36.07 8.64,35.56 9.14,35.05 14.73,35.05 v15.49,34.29 | v7.87,35.81 8.13,36.07 8.64,36.07
FTDI_3V3  (via drill 0.38)
  Top 0.254: U6.P$20 19.81,37.5 21.34,35.98 | 13.97,14.48 14.1,14.61 | U6.P$42 13.22,46.22 v12.7,46.74 | C8.+ 4.19,13.07 | 13.97,21.34 13.86,21.22 | 2.68,45.21 R29.2 C16.1 1.27,47.49 D8.A D7.A | 21.34,35.98 21.34,30.99 20.33,29.98 R22.1 19.43,29.84 18.9,29.31 R21.1 | 21.34,35.98 21.34,41.4 19.74,43 U6.P$31 | C9.1 R17.2 13.97,25.65 | U6.P$50 8.31,43 7.87,43.43 v7.87,46.23 | U7.16 14.35,8 13.97,7.62 | U7.10 14.61,15.62 13.97,14.99 | 2.68,45.21 3.85,45.21 U8.6 | 2.68,45.21 2.68,46.37 v2.79,46.48 | U6.P$56 8.01,40 7.11,40.89 v6.86,40.89 | L2.1 v15.23,29.73 v15.24,29.72
  Top 0.61: 13.97,19.3 13.97,14.99 13.97,14.48 13.97,7.62 13.97,4.19 15.37,2.54 JP1.1 | 13.97,19.3 13.97,21.34 13.97,25.65 v13.97,27.43 13.97,27.69 14.35,28.07 U5.1 R21.1 | U4.2 13.97,19.3 | L1.1 12.32,29.08 11.94,28.7 9.14,28.7 8.89,28.45 8.89,26.42 v8.13,25.65
  Top 0.813: U4.4 1.98,16.43 C8.+
  Top 1.016: U4.4 U4.2
  Top 1.422: v2.03,21.84 1.98,21.79 U4.4 1.98,23.82 v2.03,23.88 | v2.03,21.84 v2.03,22.86 v2.03,23.88 | v2.03,14.73 v2.03,21.84 | v2.03,21.84 v2.03,23.88
  Bottom 0.254: v12.7,46.74 12.19,46.23 v7.87,46.23 | v2.79,46.48 3.56,47.24 6.86,47.24 v7.87,46.23 | v6.86,40.89 7.37,40.89 7.87,41.4 v7.87,46.23 | v15.24,29.72 15.24,28.7 v13.97,27.43
  Bottom 0.61: v8.13,25.65 3.81,25.65 v2.03,23.88 2.79,24.64 v2.79,46.48
  Bottom 1.422: v2.03,21.84 v2.03,23.88 v2.03,16.76 v2.03,15.75 v2.03,14.73
FTDI_CLK  (via drill 0.38)
  Top 0.254: U8.4 5.78,46.04 v5.33,46.48 | U6.P$62 8.21,37 7.37,37.85 7.37,38.61 v7.11,38.86
  Bottom 0.254: v5.33,46.48 5.84,45.97 5.84,40.13 v7.11,38.86
FTDI_CS  (via drill 0.38)
  Top 0.254: U8.5 4.83,45.97 v4.32,46.48 | U6.P$63 7.95,36.5 v6.6,37.85
  Bottom 0.254: v6.6,37.85 5.33,39.12 5.33,44.7 4.32,45.72 v4.32,46.48
FTDI_DATA
  Top 0.254: U8.3 5.78,42.1 5.33,41.65 R31.2 5.33,40.39 6.1,39.62 7.62,39.62 7.87,39.37 7.87,38.1 8.47,37.5 U6.P$61
GND  (via drill 0.38)
  Top 0.254: U1.34 44.6,30.89 44.7,30.99 | U1.33 45.1,30.84 44.96,30.99 | 46.6,28.58 U1.30 46.6,28.57 46.48,28.45 | U1.44 39.1,24.65 37.59,26.16 | U1.33 45.1,28.55 | U1.33 44.72,29.7 44.7,29.72 44.7,28.7 44.96,28.45 | U5.15 26.29,26.8 26.67,27.18 26.67,30.73 | U7.8 26.04,16.89 v26.67,17.53 | v50.29,16.76 C19.2 | U2.2 57.15,28.19 56.39,28.96 v56.39,29.21 | U3.2 v59.18,23.37 | S2.P$2 v63.5,19.05 | R10.1 v56.63,13.47 v56.64,13.46 | R9.1 v56.63,10.93 v56.64,10.92 v56.63,10.91 R8.1
  Top 0.61: U7.2 23.75,9.27 22.23,7.75 R25.2
  Top 0.813: JP2.2 J2.1
  other vias: 34.04,18.03 29.21,3.81 61.72,5.33 61.72,2.29 26.92,8.64 30.23,41.4 29.21,46.99 55.12,40.64 58.93,40.39 63.5,10.67 30.23,37.59 45.34,34.54 28.19,25.4 59.94,35.56 62.99,35.56 50.04,20.32 35.56,27.43 44.7,38.1 48.01,25.15 39.12,18.03 35.56,23.37 63.5,5.84 63.5,4.83 63.5,2.79 63.5,1.78
  pour Bottom (isolate 0.305, rank 2): 24.13,50.16 65.53,50.16 65.53,0.64 24.13,0.64
  pour Top (isolate 0.305, rank 2): 24.13,50.16 65.53,50.16 65.53,0.64 24.13,0.64
GPIO0  (via drill 0.38)
  Top 0.254: v48.01,26.92 47.1,27.8 U1.29 47.1,31.64 v46.99,31.75 | U2.1 58.74,29.14 59.18,28.7 59.18,26.67 59.44,26.42 v59.44,25.4 | v31.75,34.04 J6.1
  Bottom 0.254: v48.01,26.92 48.77,27.69 55.12,27.69 56.13,26.67 56.13,26.42 57.15,25.4 v59.44,25.4 | v46.99,31.75 34.04,31.75 v31.75,34.04
GPIO1  (via drill 0.38)
  Top 0.254: v48.01,27.94 47.6,28.34 U1.28 47.6,31.09 48.51,32 v48.51,33.02 | v34.29,34.04 J6.2 | U2.3 57.88,26.89 v57.4,26.42
  Bottom 0.254: v48.01,27.94 48.26,28.19 55.63,28.19 v57.4,26.42 | v48.51,33.02 35.31,33.02 v34.29,34.04
GPIO2  (via drill 0.38)
  Top 0.254: U3.1 56.71,24.32 56.39,24.64 56.39,27.94 55.63,28.7 55.63,30.23 55.88,30.48 v56.39,30.48 | v36.83,29.72 J6.3 | U1.37 42.05,29.57 v41.4,30.23
  Bottom 0.254: v36.83,29.72 37.34,30.23 v41.4,30.23 54.36,30.23 54.61,30.48 v56.39,30.48
GPIO3  (via drill 0.38)
  Top 0.254: U1.38 40.68,27.65 39.62,28.7 39.62,32.51 40.13,33.02 40.13,35.56 39.37,36.32 39.37,36.58 | 39.37,36.58 J6.4 | U3.3 56.58,22.42 55.88,23.11 55.88,27.69 55.12,28.45 55.12,35.05 v55.63,35.56 | 39.37,36.58 v39.88,36.58
  Bottom 0.254: v55.63,35.56 53.98,35.56 52.96,36.58 v39.88,36.58
GPIO4  (via drill 0.38)
  Top 0.254: U1.39 40.41,27.15 39.12,28.45 39.12,33.78 v39.37,34.04 | J6.5 41.91,35.81 41.4,35.31 v41.4,34.29
  Bottom 0.254: v41.4,34.29 39.62,34.29 v39.37,34.04
GPIO5  (via drill 0.38)
  Top 0.254: v37.59,43.69 37.59,43.43 38.35,42.67 38.35,42.16 38.86,41.66 38.86,40.64 38.61,40.39 38.61,28.19 40.15,26.65 U1.40
  Bottom 0.254: v37.59,43.69 37.85,43.94 43.94,43.94 44.45,44.45 J6.6
GPIO6  (via drill 0.38)
  Top 0.254: v37.59,42.42 37.59,42.16 38.35,41.4 38.35,40.89 38.1,40.64 38.1,27.94 39.89,26.15 U1.41
  Bottom 0.254: v37.59,42.42 38.35,43.18 43.94,43.18 44.96,44.2 47.75,44.2 48.26,44.7 48.26,46.99 J2.8
GPIO7  (via drill 0.38)
  Top 0.254: U1.42 39.63,25.65 37.59,27.69 v37.59,41.15
  Bottom 0.254: v37.59,41.15 39.12,42.67 44.2,42.67 44.96,43.43 49.53,43.43 50.8,44.7 50.8,46.99 J2.9
GPIO12  (via drill 0.38)
  Top 0.254: U1.47 42.96,23.15 43.69,23.88 43.69,27.94 42.67,28.96 42.67,33.02 42.16,33.53 42.16,34.8 v42.93,35.56 | v57.15,34.8 R11.1 57.77,41.77 58.17,42.16 58.52,42.16 S3.P$4 | J2.3 35.56,46.99 v35.56,35.56
  Bottom 0.254: v35.56,35.56 v42.93,35.56 43.43,36.07 52.58,36.07 53.85,34.8 v57.15,34.8
GPIO16  (via drill 0.38)
  Top 0.254: v43.18,41.15 JP4.2 | JP8.2 v48.26,41.15 48.26,40.13 49.53,38.86 49.53,33.27 49.28,33.02 49.28,32 48.1,30.83 U1.27
  Bottom 0.254: v43.18,41.15 43.18,41.66 43.69,42.16 44.45,42.16 44.96,42.67 47.61,42.67 JP8.2 v48.26,41.15 48.26,41.66
GPIO17  (via drill 0.38)
  Top 0.254: v45.72,41.15 JP6.2 | JP10.2 v50.8,39.37 50.8,33.78 49.78,32.77 49.78,31.75 48.6,30.57 U1.26
  Bottom 0.254: v45.72,41.15 45.72,40.89 47.24,39.37 v50.8,39.37
GPIO18  (via drill 0.38)
  Top 0.254: U1.24 50.66,28.81 54.61,32.77 v54.61,36.83
  Bottom 0.254: v54.61,36.83 64.52,36.83 65.02,36.32 65.02,4.83 64.01,3.81 48.26,3.81 J1.7
GPIO19  (via drill 0.38)
  Top 0.254: v33.02,34.04 33.02,46.99 J2.2 | U1.25 49.77,29.7 50.55,30.48 v50.55,32.26
  Bottom 0.254: v33.02,34.04 34.54,32.51 47.5,32.51 47.75,32.26 v50.55,32.26
GPIO28  (via drill 0.38)
  Top 0.254: U1.48 39.41,22.65 35.31,18.54 v35.31,11.94 | v39.37,11.94 S4.P$1 39.37,10.65 39.37,7.37 38.1,6.1 38.1,3.81 J1.3
  Bottom 0.254: v39.37,11.94 v35.31,11.94
GPIO29  (via drill 0.38)
  Top 0.254: U1.1 43.59,21.08 39.12,21.08 36.07,18.03 v36.07,14.73 | v39.37,14.73 S4.P$3 40.64,13.21 40.89,12.95 40.89,11.68 41.15,11.43 41.15,9.4 41.4,9.14 41.4,7.87 40.64,7.11 40.64,3.81 J1.4
  Bottom 0.254: v39.37,14.73 v36.07,14.73
GPIO32  (via drill 0.38)
  Top 0.254: U1.31 46.1,33.15 48.26,35.31 48.26,38.61 46.99,39.88 44.96,39.88 44.45,40.39 v44.45,41.15 JP5.2 | v49.53,41.15 JP9.2
  Bottom 0.254: v49.53,41.15 49.53,40.64 49.28,40.39 47.88,40.39 47.62,40.64 47.62,41.66 47.37,41.91 45.21,41.91 v44.45,41.15
GPIO33  (via drill 0.38)
  Top 0.254: U1.36 43.6,33.36 v42.93,34.04 | v46.99,41.15 JP7.2 | v52.07,35.05 v52.07,41.15 JP11.2
  Bottom 0.254: v42.93,34.04 43.43,33.53 47.5,33.53 47.75,33.78 50.8,33.78 v52.07,35.05 | v52.07,41.15 51.31,41.15 50.04,39.88 47.5,39.88 46.99,40.39 v46.99,41.15
GPIO34  (via drill 0.38)
  Top 0.254: U1.19 53.34,25.65 54.1,24.89 54.1,20.83 55.63,19.3 v55.63,16.51 | v52.58,8.13 52.58,9.38 S1.1 | 55.48,8.24 v55.37,8.13 55.63,8.39 R8.2 | v58.93,15.24 58.93,10.67 57.66,9.4 57.66,8.38 v57.4,8.13
  Bottom 0.254: v55.63,16.51 57.66,16.51 v58.93,15.24 | v57.4,8.13 v55.37,8.13 v52.58,8.13 52.07,7.62 43.69,7.62 43.18,7.11 43.18,3.81 J1.5
J2
  Top 0.254: J2.6 43.18,46.99 JP4.1 JP5.1
JTAG_TRST  (via drill 0.38)
  Top 0.254: 44.96,14.73 44.96,14.71 S1.4 43.96,13.73 v43.43,13.21 | v27.43,12.95 27.3,13.08 U7.5 23.5,13.08 23.11,13.46 23.11,14.99 22.86,15.24 21.87,15.24 R28.2
  Bottom 0.254: v43.43,13.21 27.69,13.21 v27.43,12.95
N$1  (via drill 0.38)
  Top 0.254: U6.P$16 17.72,34.1 v17.78,34.04 | U5.3 16.64,25.53 v17.27,24.89 17.91,25.53 R20.1
  Bottom 0.254: v17.78,34.04 17.02,33.27 17.02,29.72 18.03,28.7 18.03,25.65 v17.27,24.89
N$2
  Top 0.254: U6.P$2 10.72,32.82 8.64,30.73 8.13,30.73 7.75,31.11 C17.1 7.37,31.5 6.6,30.73 5.08,30.73 4.32,31.5 Q3.1
N$3
  Top 0.254: C19.1 L3.1 49.02,19.81 48.6,20.23 U1.11
N$4  (via drill 0.38)
  Top 0.254: U6.P$17 18.47,35.38 v18.54,35.31 | U5.4 16.64,24.26 v17.27,23.62 17.91,22.99 R19.1
  Bottom 0.254: v17.27,23.62 18.54,24.89 18.54,28.96 17.53,29.97 17.53,32.77 18.54,33.78 v18.54,35.31
N$5  (via drill 0.38)
  Top 0.254: U6.P$18 19.12,36.5 19.3,36.32 19.3,32.51 v20.57,31.24 | R32.1 18.16,10.29 v17.27,11.18 16.64,10.54 U7.14
  Bottom 0.254: v17.27,11.18 21.08,14.48 21.08,30.73 v20.57,31.24
N$6  (via drill 0.38)
  Top 0.254: U6.P$19 19.64,37 19.81,36.83 19.81,36.32 v20.32,35.81 | U5.5 16.64,22.99 v17.27,22.35 17.27,22.1 18.9,20.47 R18.1
  Bottom 0.254: v17.27,22.35 19.05,24.13 19.05,29.21 18.03,30.23 18.03,32.51 19.05,33.53 19.05,34.54 v20.32,35.81
N$7
  Top 0.254: U6.P$3 11.22,32.56 8.89,30.23 8.13,30.23 7.75,29.84 C18.1 7.37,29.46 6.6,30.23 5.08,30.23 4.32,29.46 Q3.2
N$8
  Top 0.254: Q1.2 Q2.2 | Q1.2 28.34,22.99 C3.1 | U1.46 38.07,23.65 36.82,24.9 R7.2 33.66,24.9 Q1.2
N$9
  Top 0.254: S1.6 42.93,9.4 41.66,10.67 41.66,14.48 41.02,15.11 R4.1
N$10
  Top 0.254: S1.5 42.67,11.94 42.16,12.45 42.16,14.99 42.29,15.11 R5.1
N$11
  Top 0.254: Q1.1 Q2.1 | Q1.1 28.34,27.81 C4.1 | U1.45 38.33,24.15 36.58,25.9 R7.1 33.66,25.9 Q1.1
N$12
  Top 0.254: R29.1 2.54,43.18 3.08,42.64 U8.1 3.88,42.1 4.33,41.65 R31.1
N$13  (via drill 0.38)
  Top 0.254: U6.P$21 20.22,38 v20.32,38.1 | U7.12 16.64,13.08 v17.27,13.72 17.27,14.73 17.91,15.37 R28.1
  Bottom 0.254: v20.32,38.1 21.59,36.83 21.59,35.05 21.08,34.54 20.57,34.54 20.07,34.04 20.07,33.02 19.05,32 19.05,30.73 20.07,29.72 20.07,16 v17.27,13.72
N$14
  Top 0.254: U6.P$32 18.86,43.5 19.43,44.07 R23.1
N$15
  Top 0.254: U6.P$41 U6.P$40
N$16  (via drill 0.38)
  Top 0.254: U6.P$38 15.22,45.45 v15.49,45.72 | U5.6 16.64,21.72 v17.27,21.08 17.27,19.3 18.67,17.91 R16.1
  Bottom 0.254: v15.49,45.72 15.49,44.96 19.56,40.89 19.56,37.85 21.08,36.32 21.08,35.31 20.83,35.05 20.32,35.05 19.56,34.29 19.56,33.27 18.54,32.26 18.54,30.48 19.56,29.46 19.56,23.37 v17.27,21.08
N$17
  Top 0.254: U6.P$6 12.72,34.56 12.19,34.04 12.19,33.27 13.34,32.13 R24.2
N$18
  Top 0.254: U1.32 45.6,33.41 47.24,35.05 C5.1
N$19
  Top 0.254: U6.P$54 8.78,41 7.11,42.67 7.11,48.01 6.35,48.77 R26.1
N$20
  Top 0.254: 11.72,30.91 U6.P$4 | C11.1 11.53,30.73 11.72,30.91 | L1.2 11.91,30.73 11.72,30.91
N$21  (via drill 0.38)
  Top 0.254: U6.P$39 14.72,45.48 v14.48,45.72 | U7.13 16.64,11.81 v17.27,12.45 17.65,12.83 R30.1
  Bottom 0.254: v14.48,45.72 15.24,46.48 15.75,46.48 16.26,45.97 16.26,44.96 20.07,41.15 20.07,39.5 22.1,37.47 22.1,34.8 21.34,34.04 20.83,34.04 20.57,33.78 20.57,32.77 19.56,31.75 19.56,30.99 20.57,29.97 20.57,15.24 v17.27,12.45
N$22
  Top 0.254: U6.P$55 8.52,40.5 6.6,42.42 6.6,47.24 6.35,47.5 R27.1
N$23
  Top 0.254: D7.C R26.2
N$24
  Top 0.254: D8.C R27.2
N$25
  Top 0.254: U1.43 39.37,25.15 35.56,28.96 C6.1
N$26
  Top 0.254: U6.P$9 14.22,34.55 14.73,34.04 14.73,33.53 14.35,33.15 L2.2 15.74,30.73 16,30.99 C10.1
N$27
  Top 0.254: D1.A R1.1
N$28
  Top 0.254: D2.C 61.98,29.46 61.66,29.14 U2.6
N$29
  Top 0.254: D4.C 62.23,26.67 61.66,27.24 U2.4
N$30
  Top 0.254: D2.A 64.25,28.94 64.01,28.7 64.01,28.2 R12.1
N$31
  Top 0.254: D4.A 64.25,26.15 64.01,25.91 R13.1
N$32
  Top 0.254: D6.A 10.27,26.82 10.27,26.3 10.41,26.16 10.41,25.66 R17.1
N$34
  Top 0.254: R22.2 19.43,31.37 18.29,32.51 18.03,32.51 16.72,33.83 U6.P$14
N$35
  Top 0.254: U3.6 61.79,24.32 61.98,24.13 D3.C
N$36
  Top 0.254: D5.C 61.98,21.59 61.15,22.42 U3.4
N$37
  Top 0.254: D3.A 64.25,23.61 64.01,23.37 R14.1
N$38
  Top 0.254: D5.A 64.25,21.07 64.01,20.83 R15.1
N$39
  Top 0.254: U1.35 44.1,34.45 44.7,35.05 C20.1 L4.1
N$40
  Bottom 0.254: 25.4,45.47 28.45,45.47 28.45,42.42 25.4,42.42 25.4,45.47
N$41
  Top 0.254: JP9.1 JP8.1 48.26,44.45 J6.7
N$42
  Top 0.254: J2.7 45.72,46.99 JP6.1 JP7.1
N$48
  Top 0.254: JP11.1 JP10.1 50.8,44.45 J6.8
RESET#  (via drill 0.38)
  Top 0.254: U1.3 44.6,22.25 44.96,22.61 | 44.96,22.61 49.02,22.61 49.78,21.84 v50.29,21.84 | J2.5 40.64,46.99 v40.64,28.7 | v44.7,27.43 44.7,23.37 44.96,23.11 44.96,22.61 | 57.66,17.25 56.98,17.25 R6.1 | 57.66,17.25 S2.P$4 | v57.66,20.83 57.66,17.25
  Bottom 0.254: v40.64,28.7 43.94,28.7 44.45,28.19 44.45,27.69 v44.7,27.43 | v50.29,21.84 55.12,21.84 56.13,20.83 v57.66,20.83
SCI_RX
  Top 0.254: R16.2 22.73,17.91 23.37,18.54 23.37,21.34 23.75,21.72 U5.11 26.29,21.72 27.94,20.07 27.94,18.54 28.96,17.53 29.46,17.53 30.73,16.26 32,16.26 32.77,15.49 32.77,11.18 32.26,10.67 S4.P$2
SCI_TX
  Top 0.254: S4.P$4 29.72,13.21 28.32,11.81 U7.4 22.73,11.81 21.74,12.8 R30.2
TCK  (via drill 0.38)
  Top 0.254: v28.7,31.11 28.07,31.11 27.18,30.23 27.18,26.67 26.04,25.53 U5.14 R20.2 | U1.23 51.78,27.65 54.1,29.97 v54.1,30.99
  Bottom 0.254: v28.7,31.11 53.98,31.11 v54.1,30.99
TDI  (via drill 0.38)
  Top 0.254: U1.20 53.84,26.15 v53.85,26.16 | R19.2 22.73,22.99 23.37,23.62 23.37,23.88 23.75,24.26 U5.13 26.54,24.26 v26.92,23.88
  Bottom 0.254: v53.85,26.16 50.93,26.16 48.9,24.13 43.05,24.13 40.51,21.59 27.94,21.59 27.69,21.84 27.69,23.11 v26.92,23.88
TDO  (via drill 0.38)
  Top 0.254: U1.22 52.55,27.15 53.09,27.69 55.12,27.69 55.37,27.43 55.37,22.61 56.39,21.59 58.42,21.59 58.67,21.34 58.67,19.3 58.93,19.05 59.94,19.05 60.45,18.54 v60.45,9.91 | R9.2 S1.2 52.56,11.16 v52.07,10.67 | R32.2 22.99,10.29 23.24,10.54 U7.3 26.29,10.54 v26.92,9.91
  Bottom 0.254: v26.92,9.91 37.34,9.91 37.59,10.16 38.61,10.16 38.86,9.91 46.99,9.91 47.75,10.67 v52.07,10.67 52.83,9.91 v60.45,9.91
TMS  (via drill 0.38)
  Top 0.254: U1.21 53.07,26.65 53.34,26.92 v54.61,26.92 | R18.2 21.74,20.47 23.37,22.1 23.37,22.61 23.75,22.99 U5.12 26.54,22.99 v26.92,22.61
  Bottom 0.254: v54.61,26.92 54.61,25.91 54.1,25.4 51.05,25.4 49.28,23.62 43.43,23.62 40.89,21.08 27.69,21.08 26.92,21.84 v26.92,22.61
TRST  (via drill 0.38)
  Top 0.254: U1.2 44.1,20.23 43.69,19.81 43.18,19.81 v42.67,20.32 | R10.2 S1.3 52.56,19.03 v52.83,19.3
  Bottom 0.254: v42.67,20.32 43.69,19.3 v52.83,19.3
USBVCC  (via drill 0.38)
  Top 0.254: 11.07,21.61 F1.1 | 11.68,23.23 C7.1 11.68,23
  Top 0.61: 11.07,21.61 12.22,21.61 12.95,22.35 v12.95,23.11 12.84,23.23 11.68,23.23
  Top 0.813: 11.07,21.61 U4.3
  Bottom 0.61: JP3.1 16,5.08 15.49,5.59 15.49,13.97 14.22,15.24 14.22,21.84 v12.95,23.11
XUSB
  Top 0.254: 11.43,16.51 F1.2
  Top 0.61: CON1.1 11.12,8.46 12.06,9.4 12.06,15.88 11.43,16.51

### Text on the board
Bottom: LAUNCHXL-F28027F
tPlace: RX | GND | TX | GND | GND | 3V3 | 1 | 16 | 32 | 17 | 33 | 16 | 32 | 17 | 33 | GPIO | GPIO12 | PWR | GPIO | 0 | PWR | 1 | 2 | EMU | 3 | TMS320F28027F | Boot | Serial | RST | 1 | 10 | 5V | 3V3 | Rev.B
bPlace: For evaluation only; | not FCC approved for resale.
bStop: LAUNCHXL-F28027F
214bmp: D:/SmartProjects/Snc/a4_bn_logo2.bmp